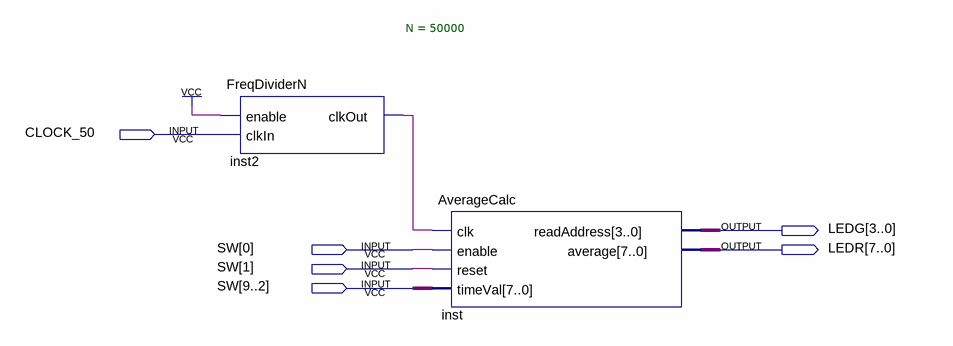
[diagram p0: schematic sheet]
// Quartus schematic Average_Test.bdf as structural Verilog: 2 symbols, 6 pins
module Average_Test (
  input  CLOCK_50,
  input  [9:0] SW,
  output [3:0] LEDG,
  output [7:0] LEDR
);

  wire inst2_clkout;

  FreqDividerN #(.N(50000)) inst2 (.enable(1'b1), .clkIn(CLOCK_50), .clkOut(inst2_clkout));
  AverageCalc inst (
    .clk(inst2_clkout), .enable(SW[0]), .reset(SW[1]), .timeVal(SW[9:2]), .readAddress(LEDG), .average(LEDR));
endmodule
